# EAGLE schematic Status Board 0.3 (EAGLE 8.5.2)
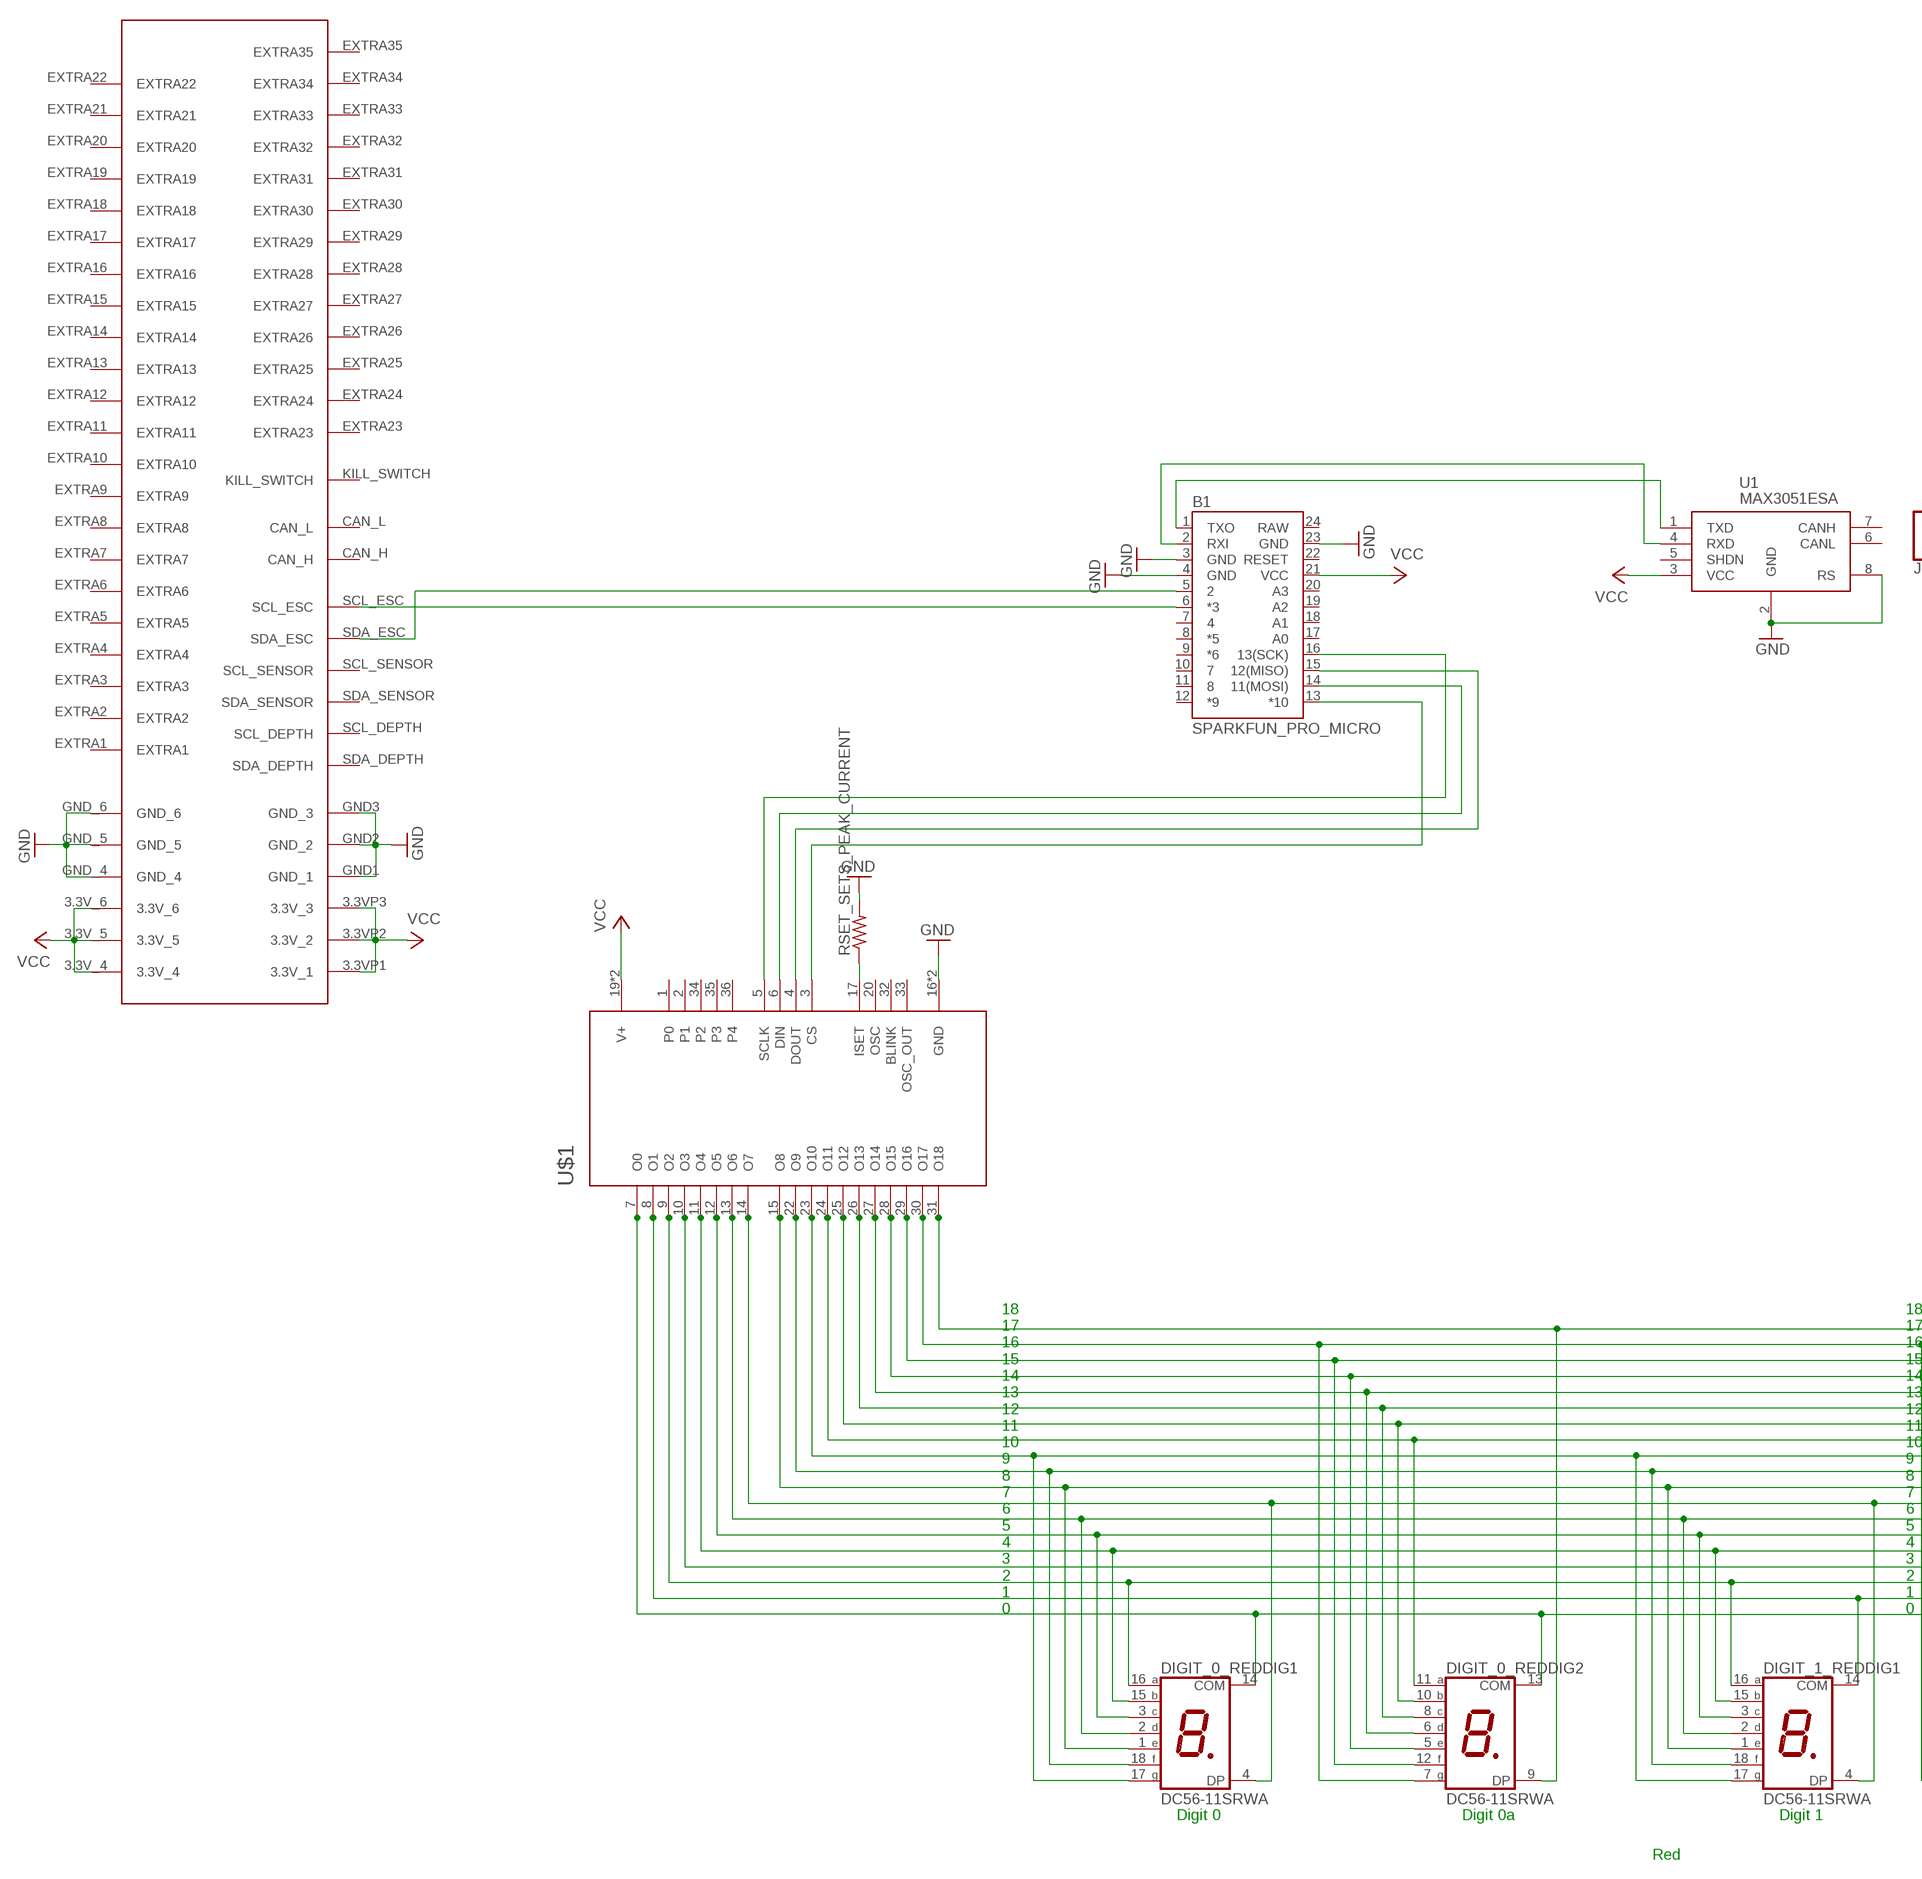
[diagram p0: schematic, sheet 1, part 1 of 3]
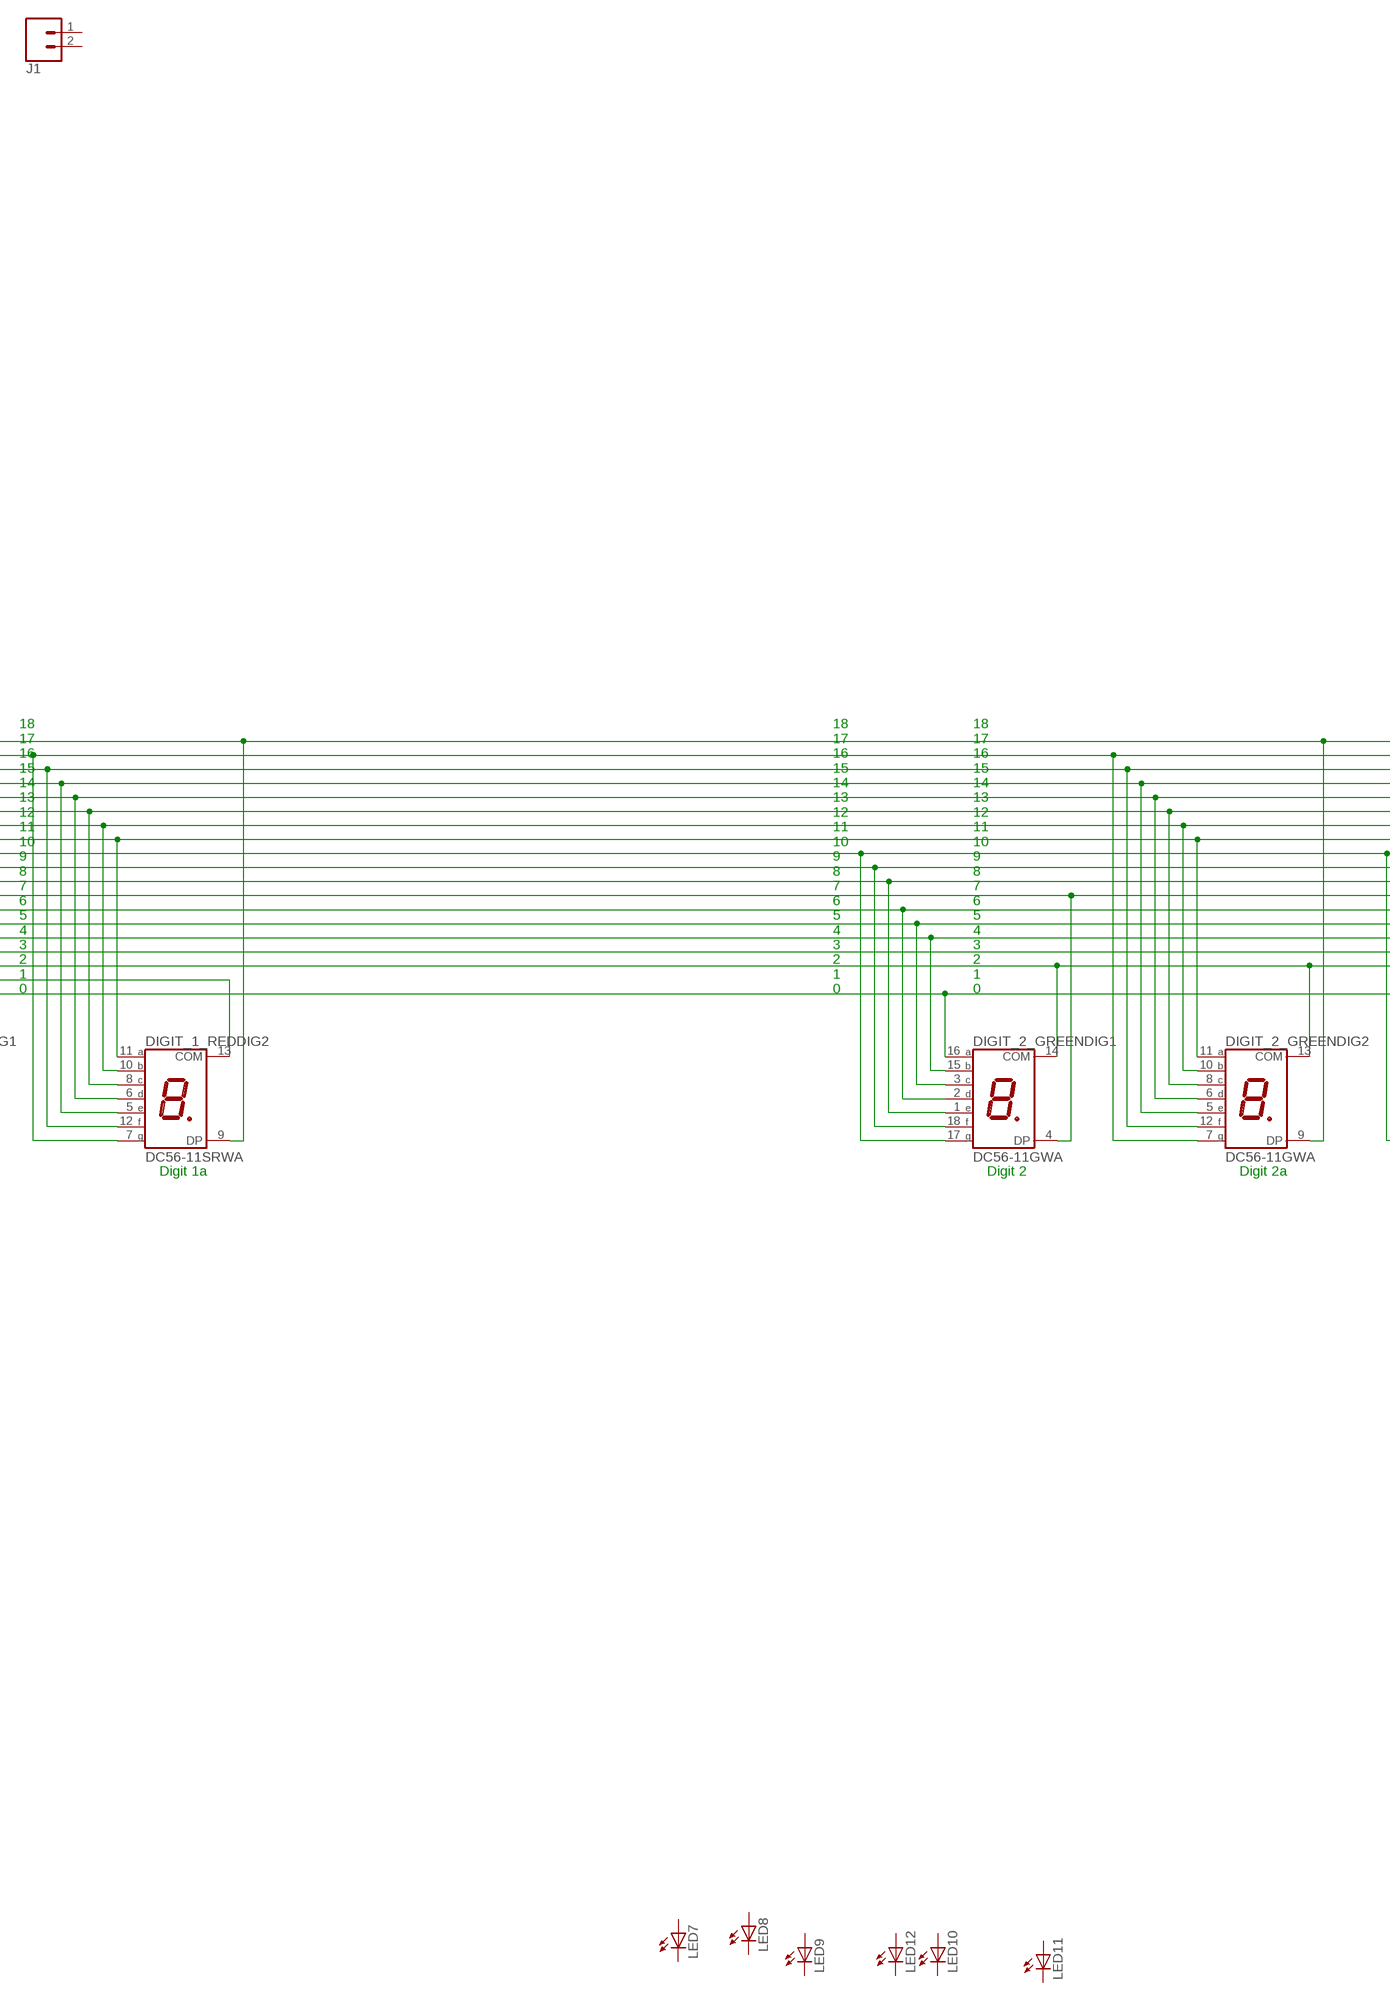
[diagram p1: schematic, sheet 1, part 2 of 3]
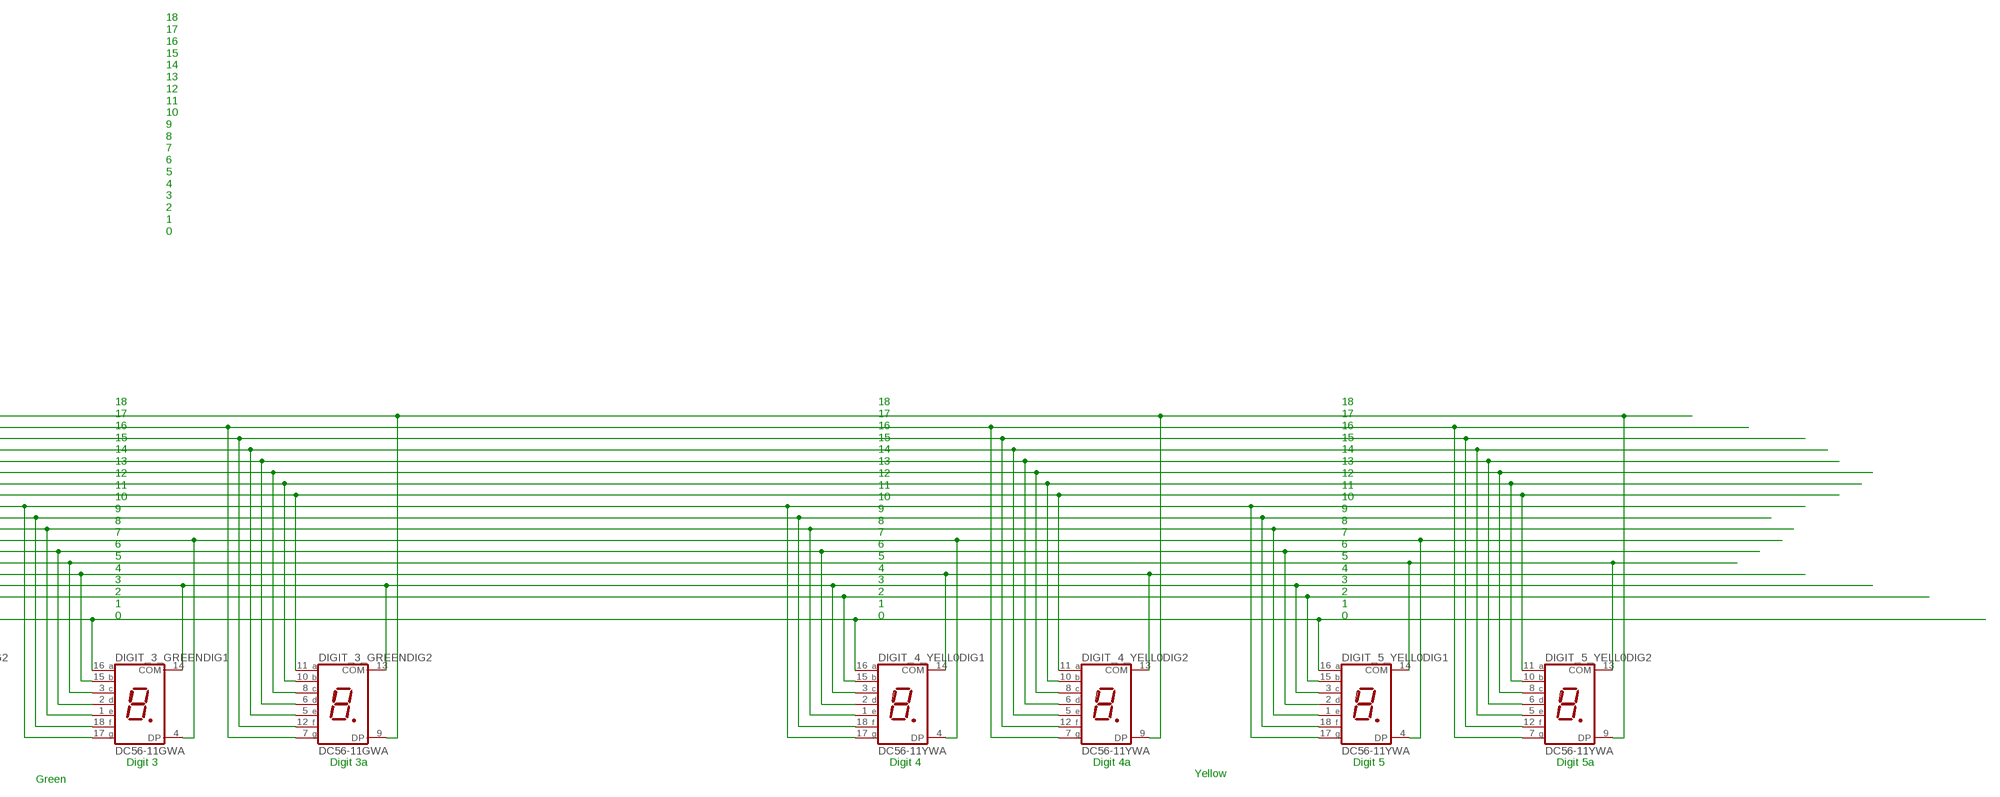
[diagram p2: schematic, sheet 1, part 3 of 3]

## Parts
B1  SPARKFUN_PRO_MICRO  [SPARKFUN_PRO_MICRO]
DIGIT_0_RED  DC56-11SRWA  [DA56]
DIGIT_1_RED  DC56-11SRWA  [DA56]
DIGIT_2_GREEN  DC56-11GWA  [DA56]
DIGIT_3_GREEN  DC56-11GWA  [DA56]
DIGIT_4_YELL0  DC56-11YWA  [DA56]
DIGIT_5_YELL0  DC56-11YWA  [DA56]
J1  CONN_02  [1X02]
LED7  LED3MM  [LED3MM]
LED8  LED3MM  [LED3MM]
LED9  LED3MM  [LED3MM]
LED10  LED3MM  [LED3MM]
LED11  LED3MM  [LED3MM]
LED12  LED3MM  [LED3MM]
RSET_SETS_PEAK_CURRENT  R-US_0207/12  [0207/12]
U1  MAX3051ESA  [8-SOICN]
U$1  MAX6954  [SSOP36]
U$2  5530843  [5530843-6-BOARDFINGERS]

## Nets
GND: B1.4(GND) RSET_SETS_PEAK_CURRENT.2 U1.2(GND) U1.8(RS) U$1.16(GND) U$1.18(GND) U$2.GND1(GND_1) U$2.GND2(GND_2) U$2.GND3(GND_3) U$2.GND_4 U$2.GND_5 U$2.GND_6
N$20: DIGIT_0_RED.13(DIG2:COM) DIGIT_0_RED.14(DIG1:COM) DIGIT_2_GREEN.16(DIG1:A) DIGIT_3_GREEN.16(DIG1:A) DIGIT_4_YELL0.16(DIG1:A) DIGIT_5_YELL0.16(DIG1:A) U$1.7(O0)
N$21: DIGIT_1_RED.13(DIG2:COM) DIGIT_1_RED.14(DIG1:COM) U$1.8(O1)
N$22: DIGIT_0_RED.16(DIG1:A) DIGIT_1_RED.16(DIG1:A) DIGIT_2_GREEN.13(DIG2:COM) DIGIT_2_GREEN.14(DIG1:COM) DIGIT_4_YELL0.15(DIG1:B) DIGIT_5_YELL0.15(DIG1:B) U$1.9(O2)
N$23: DIGIT_3_GREEN.13(DIG2:COM) DIGIT_3_GREEN.14(DIG1:COM) DIGIT_4_YELL0.3(DIG1:C) DIGIT_5_YELL0.3(DIG1:C) U$1.10(O3)
N$24: B1.14(11(MOSI)) U$1.6(DIN)
N$25: B1.15(12(MISO)) U$1.4(DOUT)
N$26: DIGIT_0_RED.15(DIG1:B) DIGIT_1_RED.15(DIG1:B) DIGIT_2_GREEN.15(DIG1:B) DIGIT_3_GREEN.15(DIG1:B) DIGIT_4_YELL0.13(DIG2:COM) DIGIT_4_YELL0.14(DIG1:COM) U$1.11(O4)
N$27: DIGIT_0_RED.3(DIG1:C) DIGIT_1_RED.3(DIG1:C) DIGIT_2_GREEN.3(DIG1:C) DIGIT_3_GREEN.3(DIG1:C) DIGIT_5_YELL0.13(DIG2:COM) DIGIT_5_YELL0.14(DIG1:COM) U$1.12(O5)
N$28: DIGIT_0_RED.1(DIG1:E) DIGIT_1_RED.1(DIG1:E) DIGIT_2_GREEN.1(DIG1:E) DIGIT_3_GREEN.1(DIG1:E) DIGIT_4_YELL0.1(DIG1:E) DIGIT_5_YELL0.1(DIG1:E) U$1.15(O8)
N$29: DIGIT_0_RED.18(DIG1:F) DIGIT_1_RED.18(DIG1:F) DIGIT_2_GREEN.18(DIG1:F) DIGIT_3_GREEN.18(DIG1:F) DIGIT_4_YELL0.18(DIG1:F) DIGIT_5_YELL0.18(DIG1:F) U$1.22(O9)
N$30: DIGIT_0_RED.17(DIG1:G) DIGIT_1_RED.17(DIG1:G) DIGIT_2_GREEN.17(DIG1:G) DIGIT_3_GREEN.17(DIG1:G) DIGIT_4_YELL0.17(DIG1:G) DIGIT_5_YELL0.17(DIG1:G) U$1.23(O10)
N$31: DIGIT_0_RED.11(DIG2:A) DIGIT_1_RED.11(DIG2:A) DIGIT_2_GREEN.11(DIG2:A) DIGIT_3_GREEN.11(DIG2:A) DIGIT_4_YELL0.11(DIG2:A) DIGIT_5_YELL0.11(DIG2:A) U$1.24(O11)
N$32: DIGIT_0_RED.10(DIG2:B) DIGIT_1_RED.10(DIG2:B) DIGIT_2_GREEN.10(DIG2:B) DIGIT_3_GREEN.10(DIG2:B) DIGIT_4_YELL0.10(DIG2:B) DIGIT_5_YELL0.10(DIG2:B) U$1.25(O12)
N$33: DIGIT_0_RED.2(DIG1:D) DIGIT_1_RED.2(DIG1:D) DIGIT_2_GREEN.2(DIG1:D) DIGIT_3_GREEN.2(DIG1:D) DIGIT_4_YELL0.2(DIG1:D) DIGIT_5_YELL0.2(DIG1:D) U$1.13(O6)
N$34: DIGIT_0_RED.6(DIG2:D) DIGIT_1_RED.6(DIG2:D) DIGIT_2_GREEN.6(DIG2:D) DIGIT_3_GREEN.6(DIG2:D) DIGIT_4_YELL0.6(DIG2:D) DIGIT_5_YELL0.6(DIG2:D) U$1.27(O14)
N$35: DIGIT_0_RED.5(DIG2:E) DIGIT_1_RED.5(DIG2:E) DIGIT_2_GREEN.5(DIG2:E) DIGIT_3_GREEN.5(DIG2:E) DIGIT_4_YELL0.5(DIG2:E) DIGIT_5_YELL0.5(DIG2:E) U$1.28(O15)
N$36: DIGIT_0_RED.12(DIG2:F) DIGIT_1_RED.12(DIG2:F) DIGIT_2_GREEN.12(DIG2:F) DIGIT_3_GREEN.12(DIG2:F) DIGIT_4_YELL0.12(DIG2:F) DIGIT_5_YELL0.12(DIG2:F) U$1.29(O16)
N$37: DIGIT_0_RED.7(DIG2:G) DIGIT_1_RED.7(DIG2:G) DIGIT_2_GREEN.7(DIG2:G) DIGIT_3_GREEN.7(DIG2:G) DIGIT_4_YELL0.7(DIG2:G) DIGIT_5_YELL0.7(DIG2:G) U$1.30(O17)
N$38: DIGIT_0_RED.9(DIG2:DP) DIGIT_1_RED.9(DIG2:DP) DIGIT_2_GREEN.9(DIG2:DP) DIGIT_3_GREEN.9(DIG2:DP) DIGIT_4_YELL0.9(DIG2:DP) DIGIT_5_YELL0.9(DIG2:DP) U$1.31(O18)
N$39: B1.16(13(SCK)) U$1.5(SCLK)
N$40: DIGIT_0_RED.8(DIG2:C) DIGIT_1_RED.8(DIG2:C) DIGIT_2_GREEN.8(DIG2:C) DIGIT_3_GREEN.8(DIG2:C) DIGIT_4_YELL0.8(DIG2:C) DIGIT_5_YELL0.8(DIG2:C) U$1.26(O13)
N$41: B1.13(*10) U$1.3(CS)
N$42: B1.6(*3) U$2.SCL_ESC
N$43: B1.5 U$2.SDA_ESC
N$44: B1.1(TXO) U1.1(TXD)
N$45: B1.2(RXI) U1.4(RXD)
N$46: RSET_SETS_PEAK_CURRENT.1 U$1.17(ISET)
N$56: DIGIT_0_RED.4(DIG1:DP) DIGIT_1_RED.4(DIG1:DP) DIGIT_2_GREEN.4(DIG1:DP) DIGIT_3_GREEN.4(DIG1:DP) DIGIT_4_YELL0.4(DIG1:DP) DIGIT_5_YELL0.4(DIG1:DP) U$1.14(O7)
VCC: B1.21(VCC) U1.3(VCC) U$1.19(V+) U$1.21(V+) U$2.3.3V_4 U$2.3.3V_5 U$2.3.3V_6 U$2.3.3VP1(3.3V_1) U$2.3.3VP2(3.3V_2) U$2.3.3VP3(3.3V_3)
Unconnected: B1.7 B1.8(*5) B1.9(*6) B1.10 B1.11 B1.12(*9) B1.17(A0) B1.18(A1) B1.19(A2) B1.20(A3) B1.22(RESET) J1.1 J1.2 LED7.A LED7.K(C) LED8.A LED8.K(C) LED9.A LED9.K(C) LED10.A LED10.K(C) LED11.A LED11.K(C) LED12.A LED12.K(C) U1.5(SHDN) U1.6(CANL) U1.7(CANH) U$1.1(P0) U$1.2(P1) U$1.20(OSC) U$1.32(BLINK) U$1.33(OSC_OUT) U$1.34(P2) U$1.35(P3) U$1.36(P4) U$2.CAN_H U$2.CAN_L U$2.EXTRA1 U$2.EXTRA2 U$2.EXTRA3 U$2.EXTRA4 U$2.EXTRA5 U$2.EXTRA6 U$2.EXTRA7 U$2.EXTRA8 U$2.EXTRA9 U$2.EXTRA10 U$2.EXTRA11 U$2.EXTRA12 U$2.EXTRA13 U$2.EXTRA14 U$2.EXTRA15 U$2.EXTRA16 U$2.EXTRA17 U$2.EXTRA18 U$2.EXTRA19 U$2.EXTRA20 U$2.EXTRA21 U$2.EXTRA22 U$2.EXTRA23 U$2.EXTRA24 U$2.EXTRA25 U$2.EXTRA26 U$2.EXTRA27 U$2.EXTRA28 U$2.EXTRA29 U$2.EXTRA30 U$2.EXTRA31 U$2.EXTRA32 U$2.EXTRA33 U$2.EXTRA34 U$2.EXTRA35 U$2.KILL_SWITCH U$2.SCL_DEPTH U$2.SCL_SENSOR U$2.SDA_DEPTH U$2.SDA_SENSOR

## Notes on the sheet
- 18
  17
  16
  15
  14
  13
  12
  11
  10
  9
  8
  7
  6
  5
  4
  3
  2
  1
  0
- 18
  17
  16
  15
  14
  13
  12
  11
  10
  9
  8
  7
  6
  5
  4
  3
  2
  1
  0
- 18
  17
  16
  15
  14
  13
  12
  11
  10
  9
  8
  7
  6
  5
  4
  3
  2
  1
  0
- 18
  17
  16
  15
  14
  13
  12
  11
  10
  9
  8
  7
  6
  5
  4
  3
  2
  1
  0
- 18
  17
  16
  15
  14
  13
  12
  11
  10
  9
  8
  7
  6
  5
  4
  3
  2
  1
  0
- 18
  17
  16
  15
  14
  13
  12
  11
  10
  9
  8
  7
  6
  5
  4
  3
  2
  1
  0
- 18
  17
  16
  15
  14
  13
  12
  11
  10
  9
  8
  7
  6
  5
  4
  3
  2
  1
  0
- 18
  17
  16
  15
  14
  13
  12
  11
  10
  9
  8
  7
  6
  5
  4
  3
  2
  1
  0
- Digit 0 | Digit 0a | Digit 1 | Digit 1a | Digit 2 | Digit 2a | Digit 3 | Digit 3a | Digit 4 | Digit 4a | Digit 5 | Digit 5a
- Yellow
- Green
- Red

## Power pins joined to a net without a drawn wire
GND: B1.3(GND) B1.23(GND)
RAW: B1.24(RAW)

## Library data of the parts
B1 = SparkFun-Boards:SPARKFUN_PRO_MICRO: SparkFun Pro Micro Atmega32U4 compatible footprint. SparkFun Products: 3.3V/8MHz <https://www.sparkfun.com/products/12587> 5V/16MHz <https://www.sparkfun.com/products/12640>
DIGIT_0_RED DIGIT_1_RED DIGIT_2_GREEN DIGIT_3_GREEN DIGIT_4_YELL0 DIGIT_5_YELL0 = display-kingbright:DC56-11: 14.22mm (0.56INCH) DUAL DIGIT NUMERIC DISPLAYS Source: www.kingbright.com .. DA56-11SRWA.pdf; OC_FARNELL: unknown; OC_NEWARK: unknown
J1 = SparkFun-Connectors:CONN_02: Multi connection point. Often used as Generic Header-pin footprint for 0.1 inch spaced/style header connections On any of the 0.1 inch spaced packages, you can populate with these: Break Away Headers - Straight <https://www.sparkfun.com/products/116> (PRT-00116) Break Away Male Headers - Right Angle <https://www.sparkfun.com/products/553> (PRT-00553) Female Headers <https://www.sparkfun.com/products/115> (PRT-00115) Break Away Headers - Machine Pin <https://www.sparkfun.com/products/117> (PRT-00117) Break Away Female Headers - Swiss Machine Pin <https://www.sparkfun.com/products/743> (PRT-00743) For SCREWTERMINALS and SPRING TERMINALS visit here: Screw Terimnals on SparkFun.com <https://www.sparkfun.com/search/results?term=Screw+Terminals> (5mm/3.5mm/2.54mm spacing) This device is also useful as a general connection point to wire up your design to another part of your project. Our various solder wires solder well into these plated through hole pads. Hook-Up Wire - Assortment (Stranded, 22 AWG) <https://www.sparkfun.com/products/11375> (PRT-11375) Hook-Up Wire - Assortment (Solid Core, 22 AWG) <https://www.sparkfun.com/products/11367> (PRT-11367) View the entire wire category on our website here <https://www.sparkfun.com/categories/141> Special notes: Molex polarized connector foot print use with: PRT-08233 with associated crimp pins and housings. 2.54_SCREWTERM for use with PRT-10571. 3.5mm Screw Terminal footprints for PRT-08084 5mm Screw Terminal footprints for use with PRT-08432
LED7-LED12 = led:LED: LED OSRAM: - CHIPLED LG R971, LG N971, LY N971, LG Q971, LY Q971, LO R971, LY R971 LH N974, LH R974 LS Q976, LO Q976, LY Q976 LO Q996 - Hyper CHIPLED LW Q18S LB Q993, LB Q99A, LB R99A - SideLED LS A670, LO A670, LY A670, LG A670, LP A670 LB A673, LV A673, LT A673, LW A673 LH A674 LY A675 LS A676, LA A676, LO A676, LY A676, LW A676 LS A679, LY A679, LG A679 - Hyper Micro SIDELED® LS Y876, LA Y876, LO Y876, LY Y876 LT Y87S - SmartLED LW L88C, LW L88S LB L89C, LB L89S, LG L890 LS L89K, LO L89K, LY L89K LS L896, LA L896, LO L896, LY L896 - TOPLED LS T670, LO T670, LY T670, LG T670, LP T670 LSG T670, LSP T670, LSY T670, LOP T670, LYG T670 LG T671, LOG T671, LSG T671 LB T673, LV T673, LT T673, LW T673 LH T674 LS T676, LA T676, LO T676, LY T676, LB T676, LH T676, LSB T676, LW T676 LB T67C, LV T67C, LT T67C, LS T67K, LO T67K, LY T67K, LW E67C LS E67B, LA E67B, LO E67B, LY E67B, LB E67C, LV E67C, LT E67C LW T67C LS T679, LY T679, LG T679 LS T770, LO T770, LY T770, LG T770, LP T770 LB T773, LV T773, LT T773, LW T773 LH T774 LS E675, LA E675, LY E675, LS T675 LS T776, LA T776, LO T776, LY T776, LB T776 LHGB T686 LT T68C, LB T68C - Hyper Mini TOPLED® LB M676 - Mini TOPLED Santana® LG M470 LS M47K, LO M47K, LY M47K Source: http://www.osram.convergy.de LUXEON: - LUMILED® LXK2-PW12-R00, LXK2-PW12-S00, LXK2-PW14-U00, LXK2-PW14-V00 LXK2-PM12-R00, LXK2-PM12-S00, LXK2-PM14-U00 LXK2-PE12-Q00, LXK2-PE12-R00, LXK2-PE12-S00, LXK2-PE14-T00, LXK2-PE14-U00 LXK2-PB12-K00, LXK2-PB12-L00, LXK2-PB12-M00, LXK2-PB14-N00, LXK2-PB14-P00, LXK2-PB14-Q00 LXK2-PR12-L00, LXK2-PR12-M00, LXK2-PR14-Q00, LXK2-PR14-R00 LXK2-PD12-Q00, LXK2-PD12-R00, LXK2-PD12-S00 LXK2-PH12-R00, LXK2-PH12-S00 LXK2-PL12-P00, LXK2-PL12-Q00, LXK2-PL12-R00 Source: www.luxeon.com KINGBRIGHT: KA-3528ASYC Source: www.kingbright.com
RSET_SETS_PEAK_CURRENT = resistor:R-US_: RESISTOR, American symbol
U1 = MAX3051ESA:MAX3051ESA: Can bus transciever Datasheet: http://datasheets.maximintegrated.com/en/ds/MAX3051.pdf; AVAILABILITY: Good; DESCRIPTION: IC TXRX CAN 1MBPS 8-SOIC; MF: Maxim Integrated; MP: MAX3051ESA+; PACKAGE: SOIC-8 Maxim Integrated; PRICE: 2.21 USD
U$1 = MAX6954:MAX6954
U$2 = 5530843-6:5530843